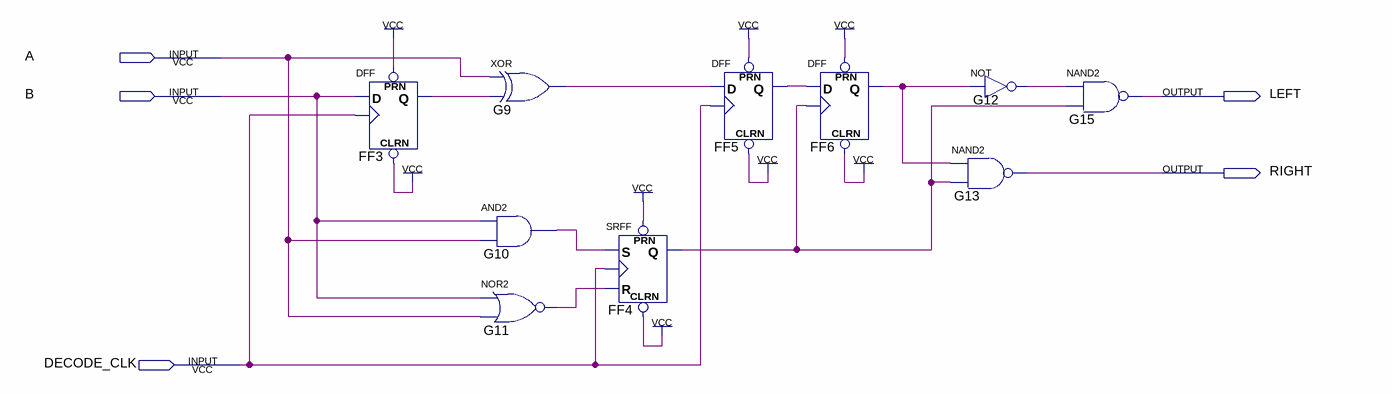
[diagram p0: schematic sheet]
// Quartus schematic decoder.bdf as structural Verilog: 10 symbols, 5 pins
module decoder (
  input  A,
  input  B,
  input  DECODE_CLK,
  output LEFT,
  output RIGHT
);

  wire FF3_q, FF4_q, FF5_q, FF6_q, G9_out, G10_out, G11_out, G12_out;

  DFF FF3 (.CLRN(1'b1), .CLK(DECODE_CLK), .D(B), .PRN(1'b1), .Q(FF3_q));
  xor G9 (G9_out, A, FF3_q);
  and G10 (G10_out, B, A);
  nor G11 (G11_out, B, A);
  SRFF FF4 (.PRN(1'b1), .CLRN(1'b1), .S(G10_out), .R(G11_out), .CLK(DECODE_CLK), .Q(FF4_q));
  DFF FF5 (.CLRN(1'b1), .CLK(DECODE_CLK), .D(G9_out), .PRN(1'b1), .Q(FF5_q));
  DFF FF6 (.CLRN(1'b1), .CLK(FF4_q), .D(FF5_q), .PRN(1'b1), .Q(FF6_q));
  nand G13 (RIGHT, FF6_q, FF4_q);
  not G12 (G12_out, FF6_q);
  nand G15 (LEFT, G12_out, FF4_q);
endmodule
